# Altium schematic sheet ADC.SchDoc
size A4; SheetNumber: 6; SheetTotal: 8
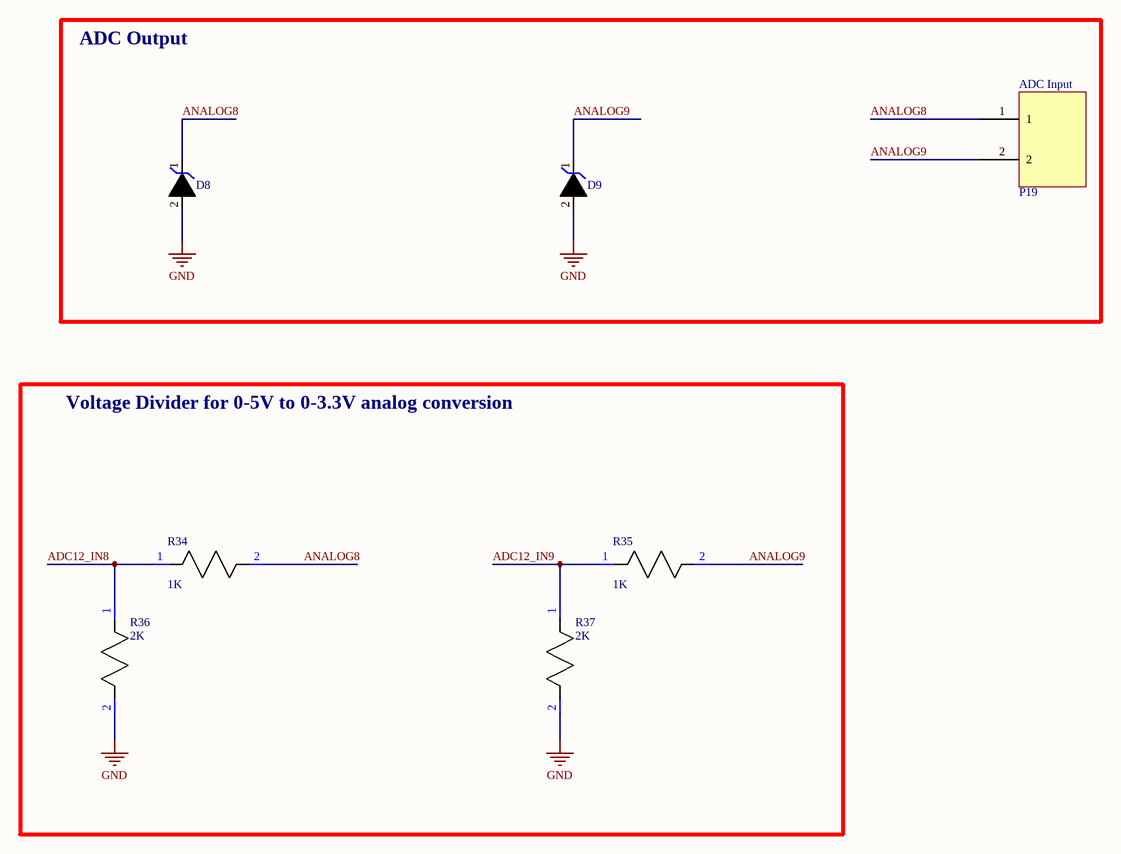
[diagram p0: ADC.SchDoc]

## Parts
D8  TVS  [TVS DIODE]  (value not drawn)
D9  TVS  [TVS DIODE]  (value not drawn)
P19  ADC Input  [WR-TBL 322 2H]
R34  value 1K  [0603 RES]  (hidden comment: Resistor)
R35  value 1K  [0603 RES]  (hidden comment: Resistor)
R36  value 2K  [0603 RES]  (hidden comment: Resistor)
R37  value 2K  [0603 RES]  (hidden comment: Resistor)

## Blocks framed on the sheet
ADC Output: D8 D9 P19
Voltage Divider for 0-5V to 0-3.3V analog conversion: R34-R37

## Nets
GND: D8.2 D9.2 R36.2 R37.2
ADC12_IN8: R34.1 R36.1
ADC12_IN9: R35.1 R37.1
ANALOG8: D8.1 P19.1 R34.2
ANALOG9: D9.1 P19.2 R35.2

## Library data of the parts
D8 D9 = TVS Diode: Schematic for TVS diode
P19 = 322-2H: 322 series 2 pin header
R34-R37 = 0603 Res: Can be used for SMD resistors